# Altium schematic sheet Sheet1.SchDoc
size A4; SheetNumber: 1; SheetTotal: 2
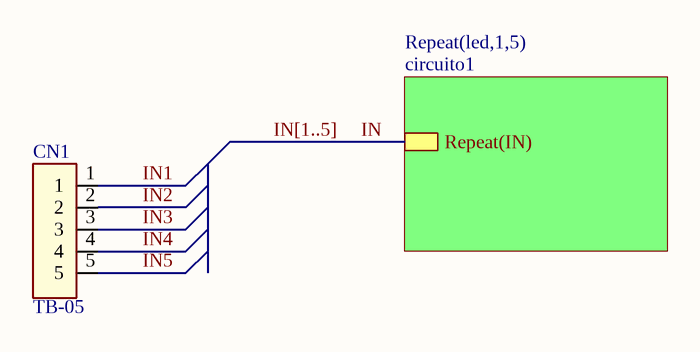
[diagram p0: Sheet1.SchDoc]

## Parts
CN1  TB-05  [TB508-05]

## Sub-sheets
Repeat(led,1,5) = circuito1: Repeat(IN)

## Nets
IN: sheet Repeat(led,1,5)/Repeat(IN)
IN1: CN1.1
IN2: CN1.2
IN3: CN1.3
IN4: CN1.4
IN5: CN1.5

## Buses and harness runs
bus IN[1..5]

## Library data of the parts
CN1 = TB-05: Terminal Block; Manufacturer: *; Part number: *; Unit price: *; Value: TB-05